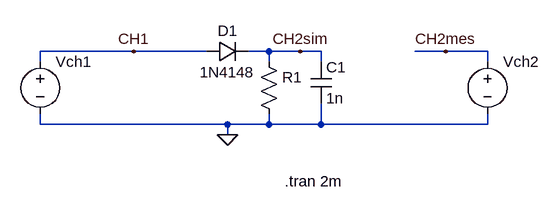
[diagram p0: schematic demASK.asc]
demASK.asc, the LTspice schematic file:
Version 4
SHEET 1 880 680
WIRE 0 128 -144 128
WIRE 112 128 0 128
WIRE 208 128 176 128
WIRE 256 128 208 128
WIRE 288 128 256 128
WIRE 480 128 432 128
WIRE 544 128 480 128
WIRE -144 144 -144 128
WIRE 208 144 208 128
WIRE 288 144 288 128
WIRE 544 144 544 128
WIRE -144 240 -144 224
WIRE 144 240 -144 240
WIRE 208 240 208 224
WIRE 208 240 144 240
WIRE 288 240 288 208
WIRE 288 240 208 240
WIRE 544 240 544 224
WIRE 544 240 288 240
WIRE 144 256 144 240
FLAG 144 256 0
FLAG 0 128 CH1
FLAG 256 128 CH2sim
FLAG 480 128 CH2mes
SYMBOL diode 112 144 R270
WINDOW 0 32 32 VTop 2
WINDOW 3 0 32 VBottom 2
SYMATTR InstName D1
SYMATTR Value 1N4148
SYMBOL res 192 128 R0
WINDOW 3 36 76 Invisible 2
SYMATTR Value 39k
SYMATTR InstName R1
SYMBOL cap 272 144 R0
SYMATTR InstName C1
SYMATTR Value 1n
SYMBOL voltage -144 128 R0
WINDOW 3 24 96 Invisible 2
WINDOW 123 0 0 Left 2
WINDOW 39 24 124 Left 2
SYMATTR Value PWL file="C:\Users\Noe.Kilchoer\HESSO\Jenni Gaëtan - TP_DS\CH1.txt"
SYMATTR InstName Vch1
SYMBOL voltage 544 128 R0
WINDOW 3 24 96 Invisible 2
WINDOW 123 0 0 Left 2
WINDOW 39 0 0 Left 2
SYMATTR Value PWL file="C:\Users\Noe.Kilchoer\HESSO\Jenni Gaëtan - TP_DS\CH2.txt"
SYMATTR InstName Vch2
TEXT 232 328 Left 2 !.tran 2m

The netlist it stands for:
* demASK.asc
D1 CH1 CH2sim 1N4148
R1 CH2sim 0 39k
C1 CH2sim 0 1n
Vch1 CH1 0 PWL file="C:\Users\Noe.Kilchoer\HESSO\Jenni Gaëtan - TP_DS\CH1.txt"
Vch2 CH2mes 0 PWL file="C:\Users\Noe.Kilchoer\HESSO\Jenni Gaëtan - TP_DS\CH2.txt"
.model D D
.lib standard.dio
.tran 2m
.backanno
.end

* Results of the author's LTspice run, read from the files saved beside the schematic
* Operating Point, zero values left out:
*   V(ch1) = 1.045 V
*   V(ch2sim) = 646.8 mV
*   V(ch2mes) = 1.186 V
*   I(D1) = 16.58 µA
*   I(R1) = 16.58 µA
*   I(Vch1) = -16.58 µA